# EAGLE design clock (EAGLE 9.6.2)
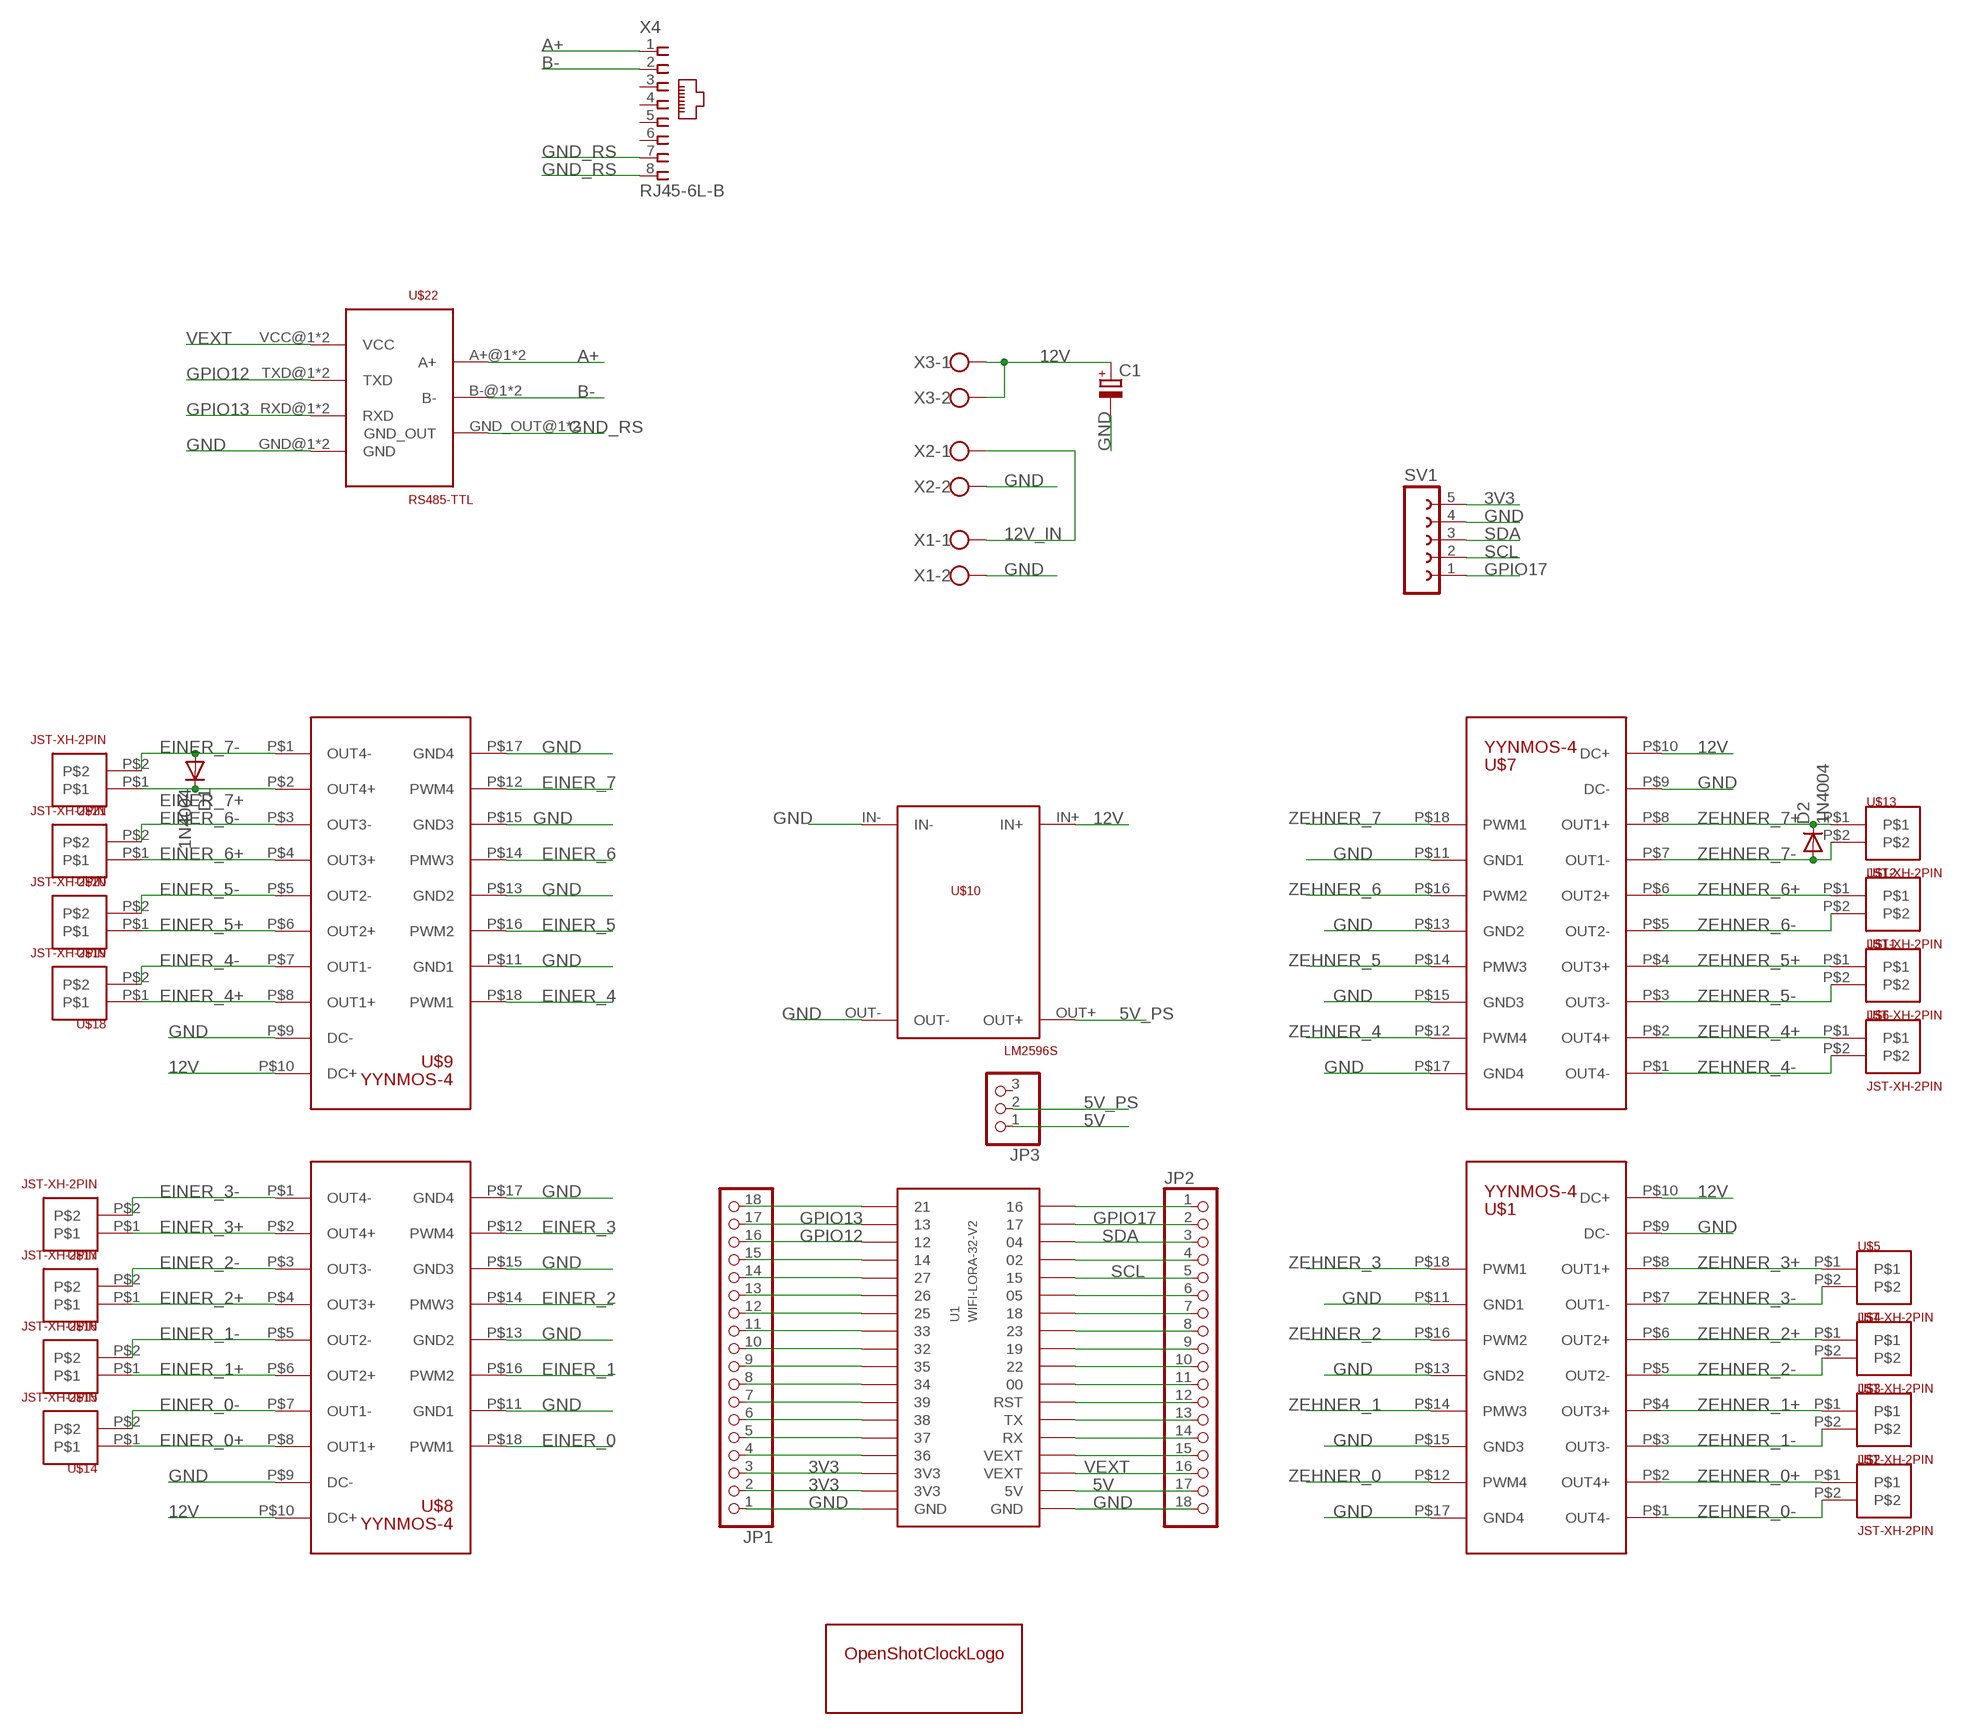
[diagram p0: schematic, sheet 1, part 1 of 2]
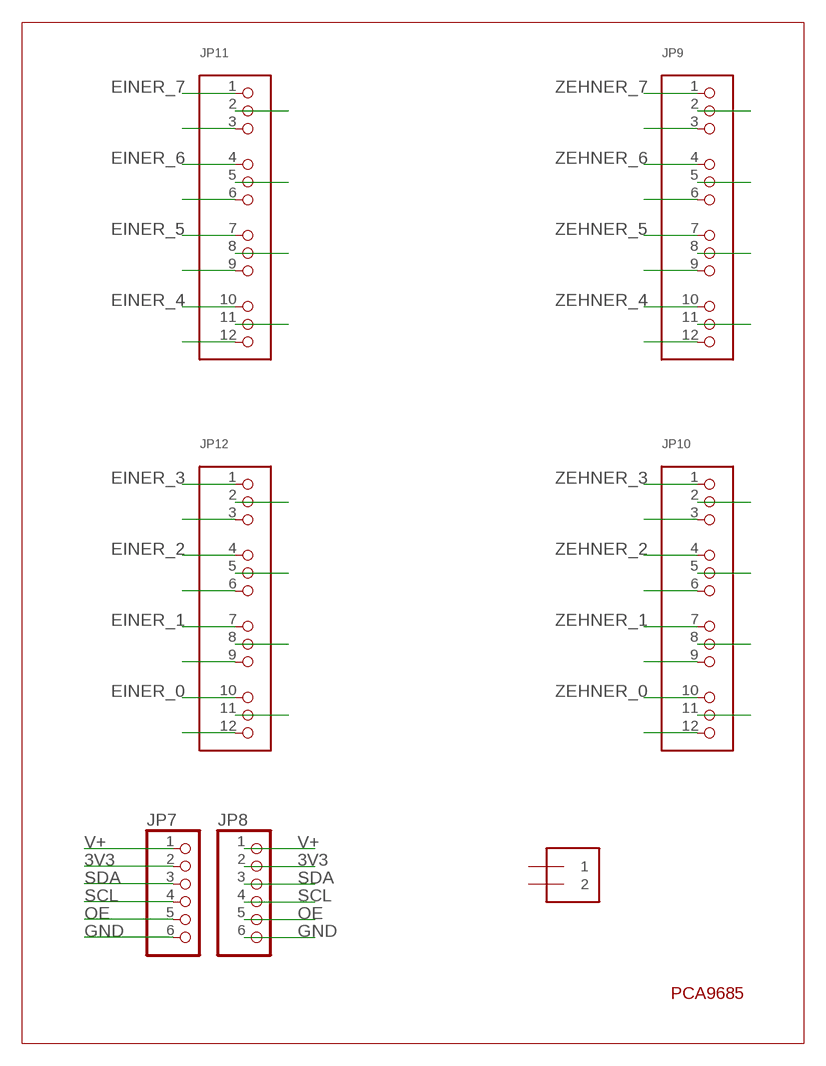
[diagram p1: schematic, sheet 1, part 2 of 2]

## Parts
C1  CPOL-EUE2.5-6  [E2,5-6]
D1  1N4004  [DO41-10]
D2  1N4004  [DO41-10]
J2  TERMBLOCK_1X2-3.5MM  [1X2-3.5MM]
JP1  PINHD-1X18  [1X18]
JP2  PINHD-1X18  [1X18]
JP3  PINHD-1X3  [1X03]
JP7  PINHD-1X6CB  [1X06-CLEANBIG]
JP8  PINHD-1X6CB  [1X06-CLEANBIG]
JP9  HEADER-3X04  [3X04]
JP10  HEADER-3X04  [3X04]
JP11  HEADER-3X04  [3X04]
JP12  HEADER-3X04  [3X04]
SV1  FE05-1  [FE05-1]
U1  WIFI-LORA-32-V2  [2.54MM_2X18]
U$1  YYNMOS-4  [YYNMOS-4]
U$2  JST-XH-2PIN  [JST-XH-2PIN]
U$3  JST-XH-2PIN  [JST-XH-2PIN]
U$4  JST-XH-2PIN  [JST-XH-2PIN]
U$5  JST-XH-2PIN  [JST-XH-2PIN]
U$6  JST-XH-2PIN  [JST-XH-2PIN]
U$7  YYNMOS-4  [YYNMOS-4]
U$8  YYNMOS-4  [YYNMOS-4]
U$9  YYNMOS-4  [YYNMOS-4]
U$10  LM2596S  [LM2596S]
U$11  JST-XH-2PIN  [JST-XH-2PIN]
U$12  JST-XH-2PIN  [JST-XH-2PIN]
U$13  JST-XH-2PIN  [JST-XH-2PIN]
U$14  JST-XH-2PIN  [JST-XH-2PIN]
U$15  JST-XH-2PIN  [JST-XH-2PIN]
U$16  JST-XH-2PIN  [JST-XH-2PIN]
U$17  JST-XH-2PIN  [JST-XH-2PIN]
U$18  JST-XH-2PIN  [JST-XH-2PIN]
U$19  JST-XH-2PIN  [JST-XH-2PIN]
U$20  JST-XH-2PIN  [JST-XH-2PIN]
U$21  JST-XH-2PIN  [JST-XH-2PIN]
U$22  RS485-TTL  [RS485-TTL]
U$23  OPEN-SHOT-CLOCK-LOGO  [OPEN-SHOT-CLOCK-LOGO]
X1  W237-102  [W237-102]
X2  W237-102  [W237-102]
X3  W237-102  [W237-102]
X4  RJ45-6L-B  [RJ45-NO-SHIELD]

## Nets
3V3: JP1.2 JP1.3 JP7.2 JP8.2 SV1.5 U1.P$34(3V3) U1.P$35(3V3)
5V: JP2.17 JP3.1 U1.P$2(5V)
5V_PS: JP3.2 U$10.OUT+
12V: C1.+ U$1.P$10(DC+) U$7.P$10(DC+) U$8.P$10(DC+) U$9.P$10(DC+) U$10.IN+ X3.1 X3.2
12V_IN: X1.1 X2.1
A+: U$22.A+@1(A+) U$22.A+@2(A+) X4.1
B-: U$22.B-@1(B-) U$22.B-@2(B-) X4.2
EINER_0: JP12.10 U$8.P$18(PWM1)
EINER_0+: U$8.P$8(OUT1+) U$14.P$1
EINER_0-: U$8.P$7(OUT1-) U$14.P$2
EINER_1: JP12.7 U$8.P$16(PWM2)
EINER_1+: U$8.P$6(OUT2+) U$15.P$1
EINER_1-: U$8.P$5(OUT2-) U$15.P$2
EINER_2: JP12.4 U$8.P$14(PMW3)
EINER_2+: U$8.P$4(OUT3+) U$16.P$1
EINER_2-: U$8.P$3(OUT3-) U$16.P$2
EINER_3: JP12.1 U$8.P$12(PWM4)
EINER_3+: U$8.P$2(OUT4+) U$17.P$1
EINER_3-: U$8.P$1(OUT4-) U$17.P$2
EINER_4: JP11.10 U$9.P$18(PWM1)
EINER_4+: U$9.P$8(OUT1+) U$18.P$1
EINER_4-: U$9.P$7(OUT1-) U$18.P$2
EINER_5: JP11.7 U$9.P$16(PWM2)
EINER_5+: U$9.P$6(OUT2+) U$19.P$1
EINER_5-: U$9.P$5(OUT2-) U$19.P$2
EINER_6: JP11.4 U$9.P$14(PMW3)
EINER_6+: U$9.P$4(OUT3+) U$20.P$1
EINER_6-: U$9.P$3(OUT3-) U$20.P$2
EINER_7: JP11.1 U$9.P$12(PWM4)
EINER_7+: D1.C U$9.P$2(OUT4+) U$21.P$1
EINER_7-: D1.A U$9.P$1(OUT4-) U$21.P$2
GND: C1.- JP1.1 JP2.18 JP7.6 JP8.6 SV1.4 U1.P$1(GND) U1.P$36(GND) U$1.P$9(DC-) U$1.P$11(GND1) U$1.P$13(GND2) U$1.P$15(GND3) U$1.P$17(GND4) U$7.P$9(DC-) U$7.P$11(GND1) U$7.P$13(GND2) U$7.P$15(GND3) U$7.P$17(GND4) U$8.P$9(DC-) U$8.P$11(GND1) U$8.P$13(GND2) U$8.P$15(GND3) U$8.P$17(GND4) U$9.P$9(DC-) U$9.P$11(GND1) U$9.P$13(GND2) U$9.P$15(GND3) U$9.P$17(GND4) U$10.IN- U$10.OUT- U$22.GND@1(GND) U$22.GND@2(GND) X1.2 X2.2
GND_RS: U$22.GND_OUT@1(GND_OUT) U$22.GND_OUT@2(GND_OUT) X4.7 X4.8
GPIO12: JP1.16 U1.P$21 U$22.TXD@1(TXD) U$22.TXD@2(TXD)
GPIO13: JP1.17 U1.P$20 U$22.RXD@1(RXD) U$22.RXD@2(RXD)
GPIO17: JP2.2 SV1.1 U1.P$17
N$1: JP1.18 U1.P$19
N$4: JP1.15 U1.P$22
N$5: JP1.14 U1.P$23
N$6: JP1.13 U1.P$24
N$7: JP1.12 U1.P$25
N$8: JP1.11 U1.P$26
N$9: JP1.10 U1.P$27
N$10: JP1.9 U1.P$28
N$11: JP1.8 U1.P$29
N$12: JP1.7 U1.P$30
N$13: JP1.6 U1.P$31
N$14: JP1.5 U1.P$32
N$15: JP1.4 U1.P$33
N$16: JP2.1 U1.P$18
N$38: JP2.4 U1.P$15
N$39: JP2.6 U1.P$13
N$40: JP2.7 U1.P$12
N$41: JP2.8 U1.P$11
N$42: JP2.9 U1.P$10
N$43: JP2.10 U1.P$9
N$44: JP2.11 U1.P$8
N$45: JP2.12 U1.P$7(RST)
N$46: JP2.13 U1.P$6(TX)
N$47: JP2.14 U1.P$5(RX)
N$48: JP2.15 U1.P$4(VEXT)
N$71: JP10.3
N$72: JP10.6
N$73: JP10.9
N$74: JP10.12
N$75: JP10.2
N$76: JP10.5
N$77: JP10.8
N$78: JP10.11
N$79: JP12.8
N$80: JP12.5
N$81: JP12.2
N$82: JP12.11
N$83: JP12.12
N$84: JP12.9
N$85: JP12.6
N$86: JP12.3
N$87: JP9.2
N$88: JP9.5
N$89: JP9.8
N$90: JP9.11
N$91: JP9.12
N$92: JP9.9
N$93: JP9.6
N$94: JP9.3
N$95: JP11.3
N$96: JP11.6
N$97: JP11.9
N$98: JP11.12
N$99: JP11.11
N$100: JP11.8
N$101: JP11.5
N$102: JP11.2
OE: JP7.5 JP8.5
SCL: JP2.5 JP7.4 JP8.4 SV1.2 U1.P$14
SDA: JP2.3 JP7.3 JP8.3 SV1.3 U1.P$16
V+: JP7.1 JP8.1
VEXT: JP2.16 U1.P$3(VEXT) U$22.VCC@1(VCC) U$22.VCC@2(VCC)
ZEHNER_0: JP10.10 U$1.P$12(PWM4)
ZEHNER_0+: U$1.P$2(OUT4+) U$2.P$1
ZEHNER_0-: U$1.P$1(OUT4-) U$2.P$2
ZEHNER_1: JP10.7 U$1.P$14(PMW3)
ZEHNER_1+: U$1.P$4(OUT3+) U$3.P$1
ZEHNER_1-: U$1.P$3(OUT3-) U$3.P$2
ZEHNER_2: JP10.4 U$1.P$16(PWM2)
ZEHNER_2+: U$1.P$6(OUT2+) U$4.P$1
ZEHNER_2-: U$1.P$5(OUT2-) U$4.P$2
ZEHNER_3: JP10.1 U$1.P$18(PWM1)
ZEHNER_3+: U$1.P$8(OUT1+) U$5.P$1
ZEHNER_3-: U$1.P$7(OUT1-) U$5.P$2
ZEHNER_4: JP9.10 U$7.P$12(PWM4)
ZEHNER_4+: U$6.P$1 U$7.P$2(OUT4+)
ZEHNER_4-: U$6.P$2 U$7.P$1(OUT4-)
ZEHNER_5: JP9.7 U$7.P$14(PMW3)
ZEHNER_5+: U$7.P$4(OUT3+) U$11.P$1
ZEHNER_5-: U$7.P$3(OUT3-) U$11.P$2
ZEHNER_6: JP9.4 U$7.P$16(PWM2)
ZEHNER_6+: U$7.P$6(OUT2+) U$12.P$1
ZEHNER_6-: U$7.P$5(OUT2-) U$12.P$2
ZEHNER_7: JP9.1 U$7.P$18(PWM1)
ZEHNER_7+: D2.C U$7.P$8(OUT1+) U$13.P$1
ZEHNER_7-: D2.A U$7.P$7(OUT1-) U$13.P$2
Unconnected: J2.1 J2.2 JP3.3 X4.3 X4.4 X4.5 X4.6

## Notes on the sheet
- PCA9685

## Library data of the parts
C1 = rcl:CPOL-EU: POLARIZED CAPACITOR, European symbol; SPICEPREFIX: C
D1 D2 = adafruit:1N4004: DIODE General purpose 1N400x type rectifier (With bigger pads) http://www.ladyada.net/library/pcb/eaglelibrary.html
J2 = microbuilder:TERMBLOCK_1X2: 3.5mm Terminal block http://www.ladyada.net/library/pcb/eaglelibrary.html
JP1 JP2 = adafruit:PINHD-1X18: PIN HEADER
JP3 = adafruit:PINHD-1X3: PIN HEADER
JP7 JP8 = adafruit:PINHD-1X6: PIN HEADER
JP9-JP12 = microbuilder:HEADER-3X04
SV1 = con-lsta:FE05-1: FEMALE HEADER; OC_FARNELL: unknown; OC_NEWARK: unknown
U1 = ESP32_modules:WIFI-LORA-32-V2
U$1 U$7-U$9 = mosfet_module:YYNMOS-4
U$2-U$6 U$11-U$21 = JST-XH:JST-XH-2PIN
U$10 = LM2596S:LM2596S
U$22 = RS485-TTL:RS485-TTL
U$23 = openShotClockLogo:OPEN-SHOT-CLOCK-LOGO
X1-X3 = con-wago-500:W237-102: WAGO SCREW CLAMP; MPN: 237-102; OC_FARNELL: unknown; OC_NEWARK: 70K9898
X4 = RJ45_from_con-tycoel:RJ45: CORCOM Modular RJ Jacks No Shield Source: www.tycoelectronics.com .. ENG_DS_1654001_1099_RJ_L_0507.pdf; MPN: RJ45-6L-B; OC_FARNELL: unknown; OC_NEWARK: 16R6090

## Board
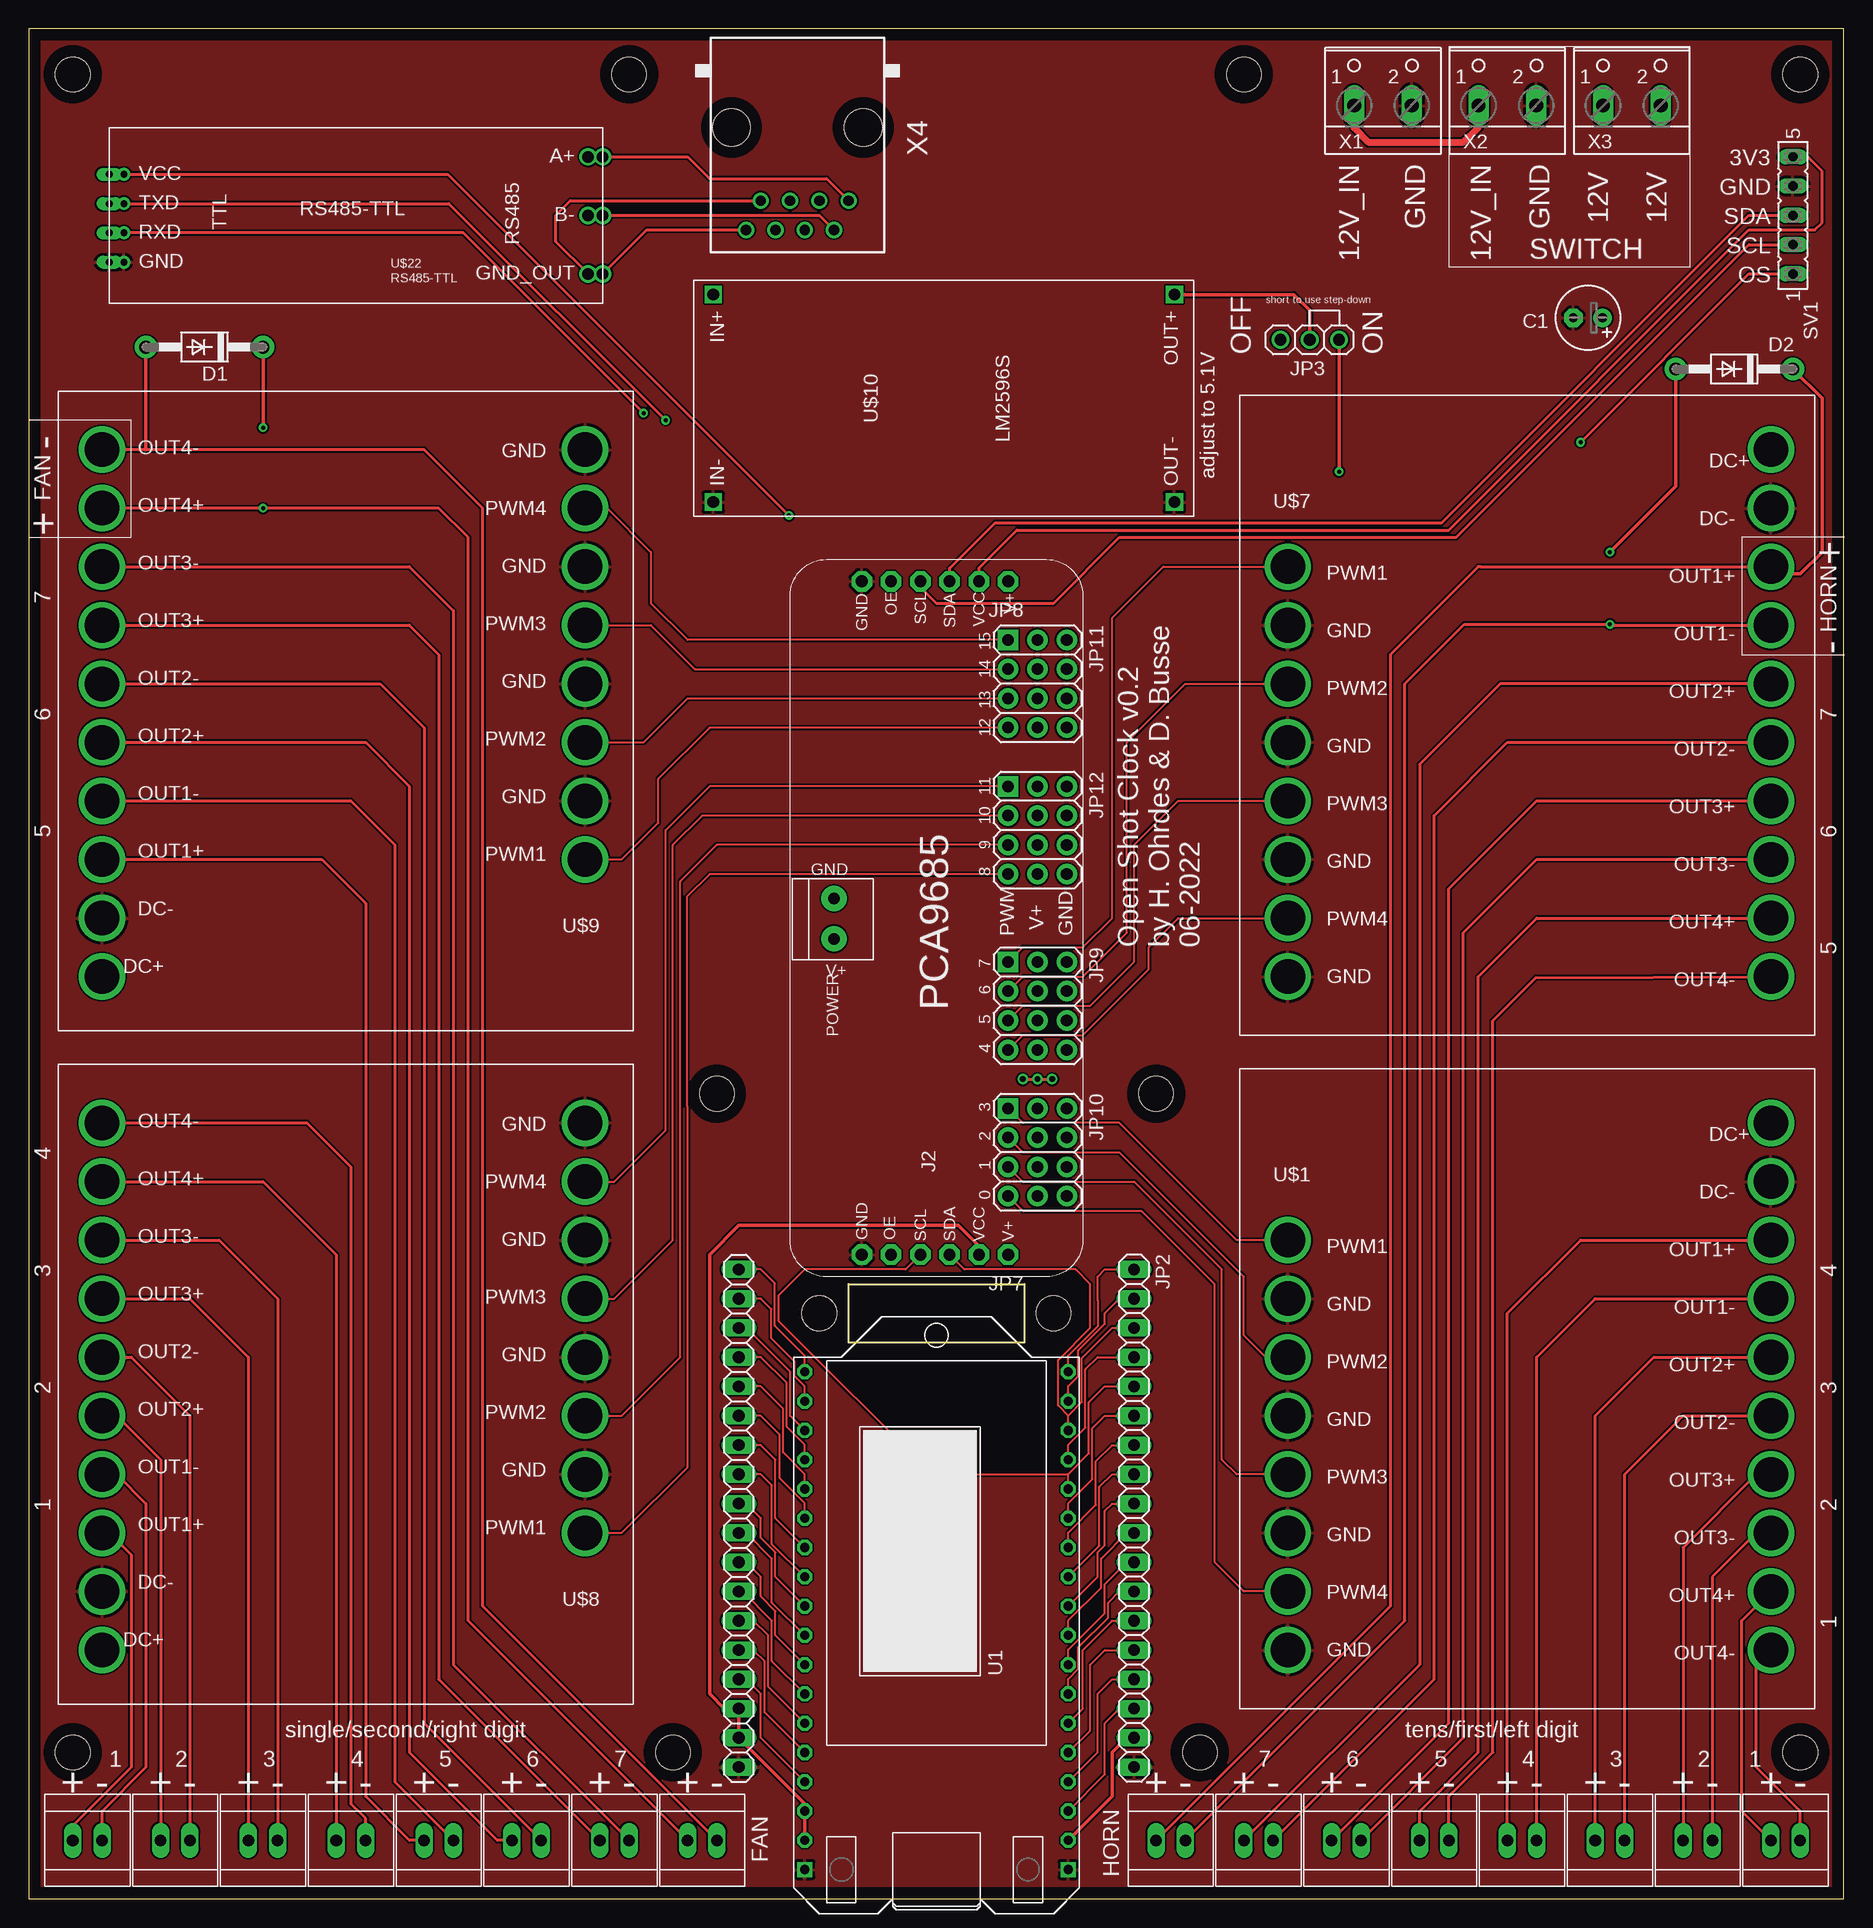
[diagram p2: board, top side]
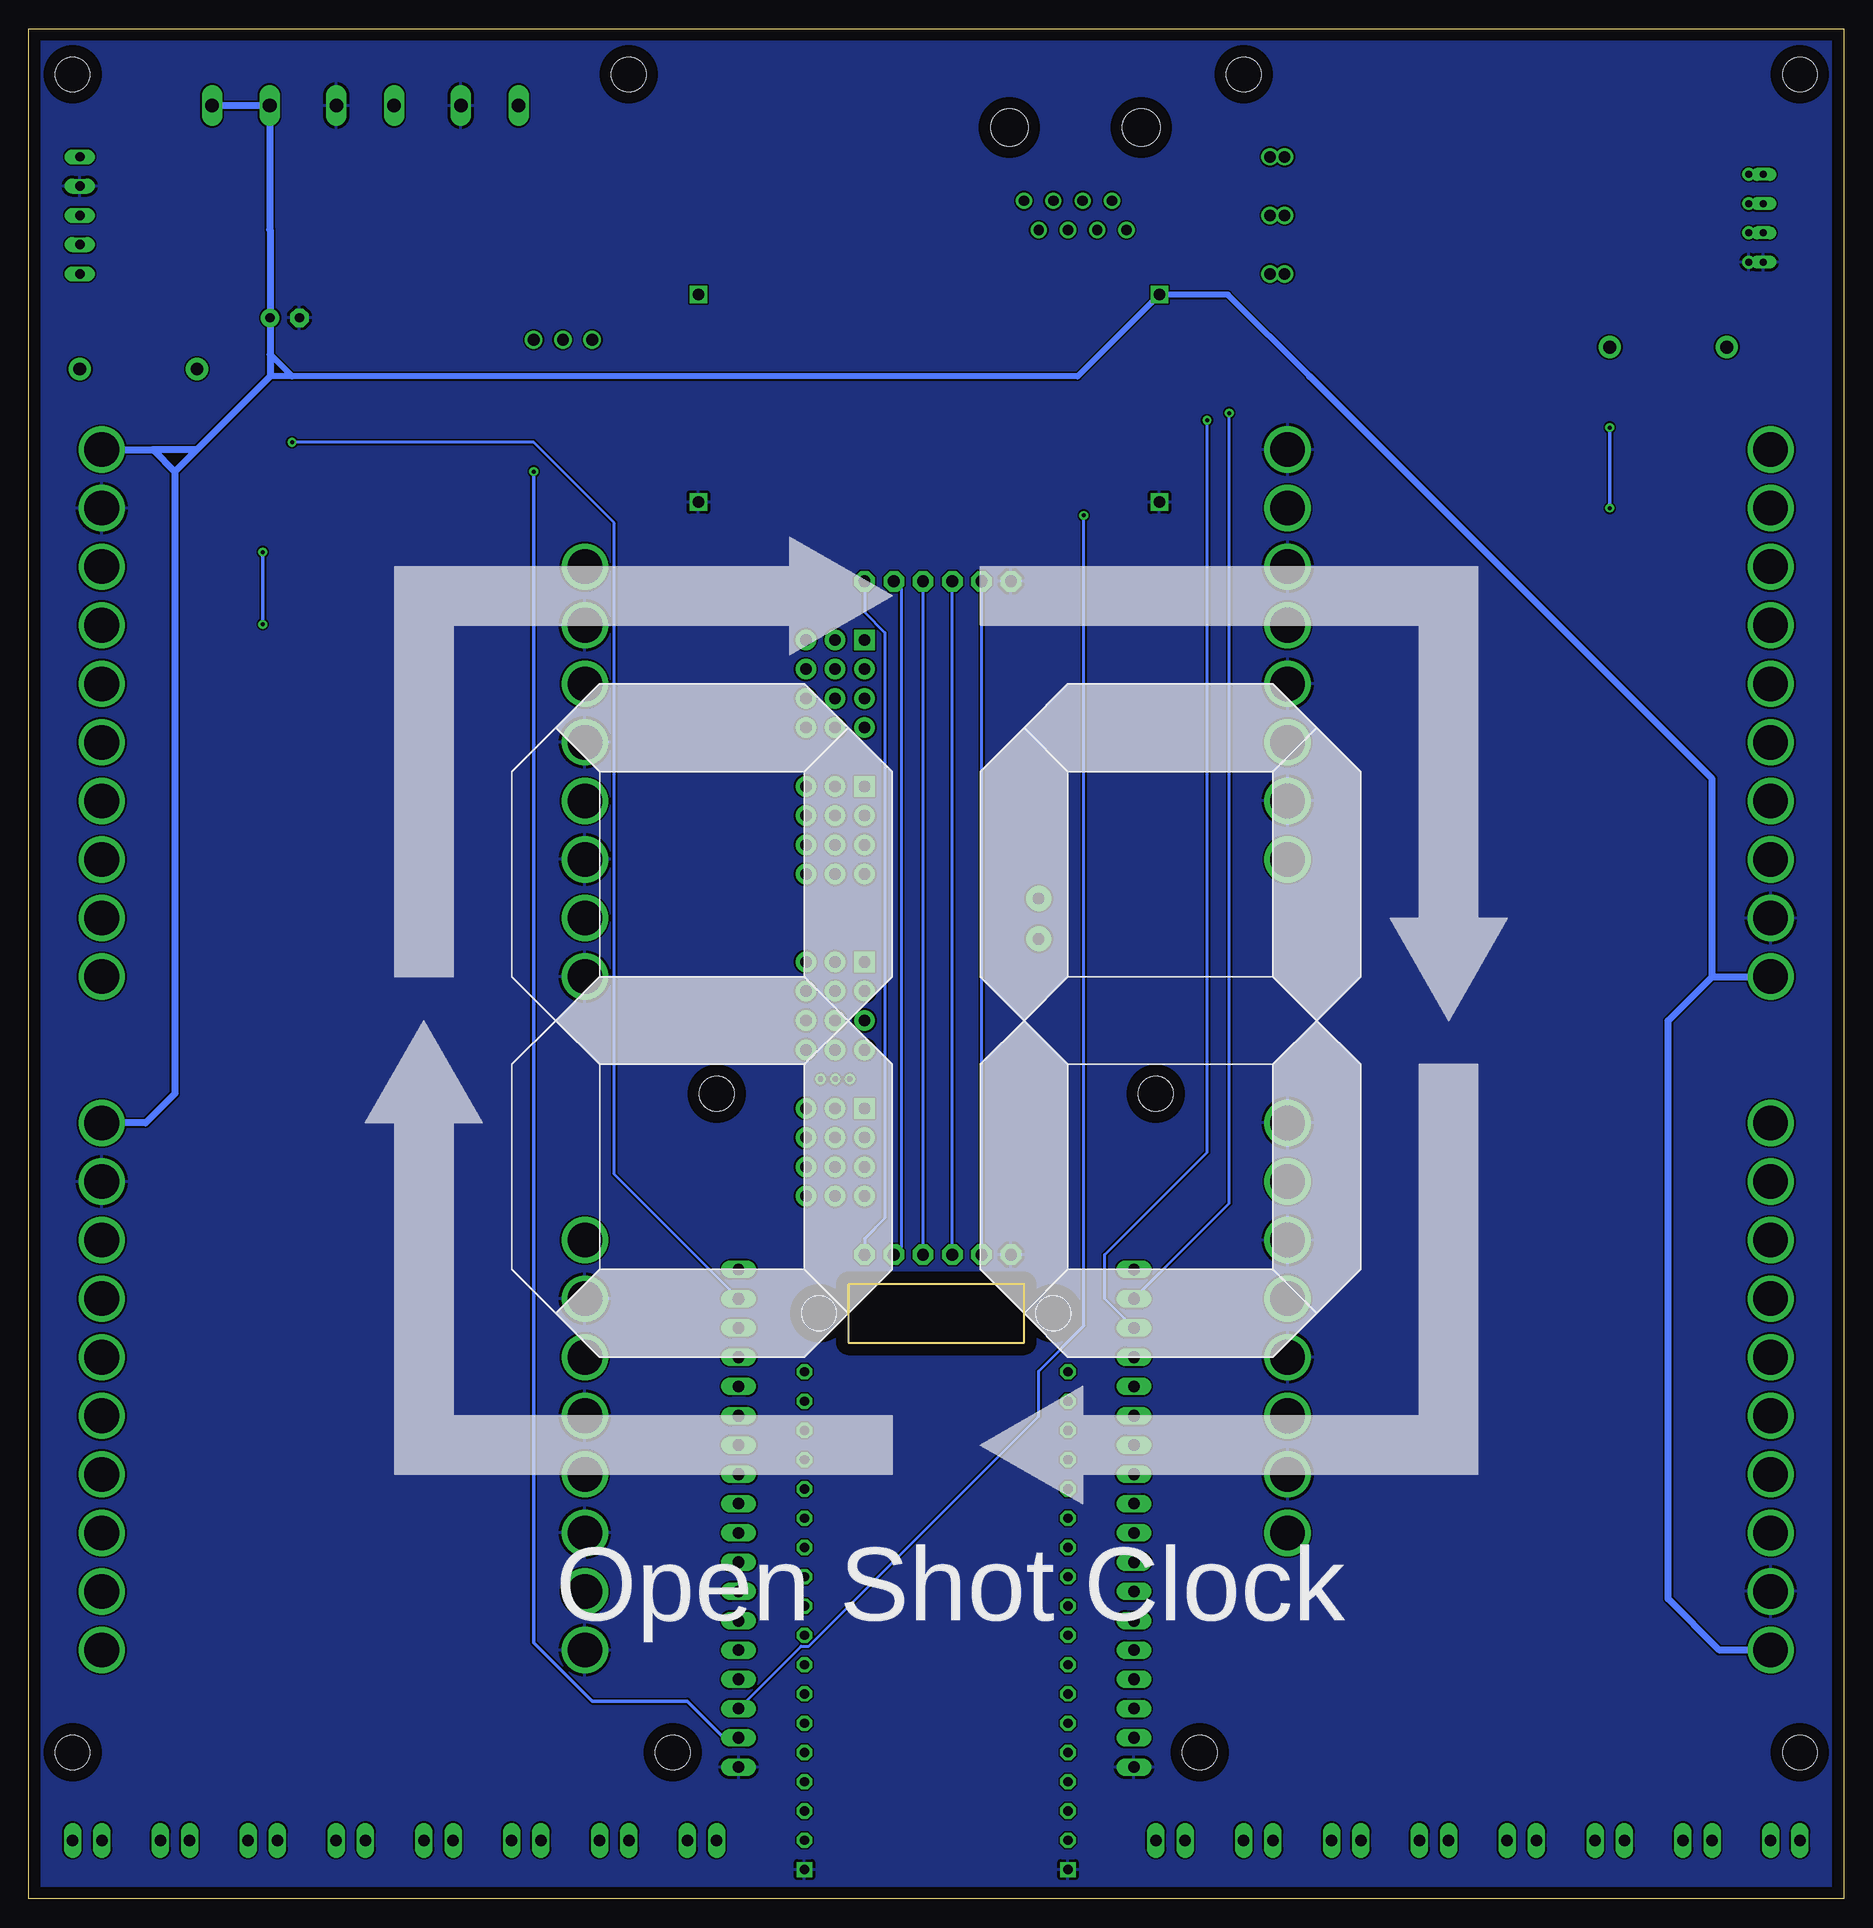
[diagram p3: board, bottom side, seen from below]

Size 157.46 x 162.23 mm. Coordinates in mm from the lower left corner, seen from the top.
Outline: 0,0 157.46,0 157.46,162.23 0,162.23 0,0
Outline: 71.12,48.26 71.12,53.34 86.36,53.34 86.36,48.26 71.12,48.26
Copper layers (1*16): Top 0.035mm / dielectric 1.5mm / Bottom 0.035mm
Design rules "default": minimum track width 6mil, minimum drill 0.35mm, track to track 6mil, track to pad 6mil, pad to pad 6mil, via to via 6mil, smd to smd 6mil, copper to edge 40mil, drill to drill 6mil, minimum pad ring 10mil, minimum via ring 8mil, stop-mask expansion 4mil, vias tented up to drill 0mil, thermal gap 10mil
Holes 3 mm at 59.69,69.85 97.79,69.85 3.81,158.27 153.67,158.27 55.88,12.7 101.6,12.7 153.67,12.7 52.07,158.27 105.41,158.27 3.81,12.7 68.58,50.8 88.9,50.8

### Footprints (pad centres in the part's own frame; a part is rotated, then mirrored left to right if it is on the bottom)
E2,5-6 = drill 0.813 pad 1.6: + -1.27,0 | drill 0.813 pad 1.6 octagon: - 1.27,0
DO41-10 = drill 1.118 pad 1.93: A 5.08,0; C -5.08,0
1X2-3.5MM = drill 1 pad 2.184: 1 1.8,0; 2 -1.7,0
1X18 = drill 1.016 long: 1 -21.59,0; 2 -19.05,0; 3 -16.51,0; 4 -13.97,0; 5 -11.43,0; 6 -8.89,0; 7 -6.35,0; 8 -3.81,0; 9 -1.27,0; 10 1.27,0; 11 3.81,0; 12 6.35,0; 13 8.89,0; 14 11.43,0; 15 13.97,0; 16 16.51,0; 17 19.05,0; 18 21.59,0
1X03 = drill 1.016: 1 -2.54,0; 2 0,0; 3 2.54,0
1X06-CLEANBIG = drill 1.016 pad 1.778 octagon: 1 -6.35,0; 2 -3.81,0; 3 -1.27,0; 4 1.27,0; 5 3.81,0; 6 6.35,0
3X04 = drill 1 pad 1.778 square: 1 -3.81,-2.54 | drill 1 pad 1.778: 2 -3.81,0; 3 -3.81,2.54; 4 -1.27,-2.54; 5 -1.27,0; 6 -1.27,2.54; 7 1.27,-2.54; 8 1.27,0; 9 1.27,2.54; 10 3.81,-2.54; 11 3.81,0; 12 3.81,2.54
FE05-1 = drill 0.813 long: 1 -5.08,0; 2 -2.54,0; 3 0,0; 4 2.54,0; 5 5.08,0
2.54MM_2X18 = drill 0.8 square: P$1 -20.32,-11.43; P$36 -20.32,11.43 | drill 0.8 octagon: P$2 -17.78,-11.43; P$3 -15.24,-11.43; P$4 -12.7,-11.43; P$5 -10.16,-11.43; P$6 -7.62,-11.43; P$7 -5.08,-11.43; P$8 -2.54,-11.43; P$9 0,-11.43; P$10 2.54,-11.43; P$11 5.08,-11.43; P$12 7.62,-11.43; P$13 10.16,-11.43; P$14 12.7,-11.43; P$15 15.24,-11.43; P$16 17.78,-11.43; P$17 20.32,-11.43; P$18 22.86,-11.43; P$19 22.86,11.43; P$20 20.32,11.43; P$21 17.78,11.43; P$22 15.24,11.43; P$23 12.7,11.43; P$24 10.16,11.43; P$25 7.62,11.43; P$26 5.08,11.43; P$27 2.54,11.43; P$28 0,11.43; P$29 -2.54,11.43; P$30 -5.08,11.43; P$31 -7.62,11.43; P$32 -10.16,11.43; P$33 -12.7,11.43; P$34 -15.24,11.43; P$35 -17.78,11.43
YYNMOS-4 = drill 3: P$1 5.08,3.81; P$2 10.16,3.81; P$3 15.24,3.81; P$4 20.32,3.81; P$5 25.4,3.81; P$6 30.48,3.81; P$7 35.56,3.81; P$8 40.64,3.81; P$9 45.72,3.81; P$10 50.8,3.81; P$11 5.08,45.72; P$12 10.16,45.72; P$13 15.24,45.72; P$14 20.32,45.72; P$15 25.4,45.72; P$16 30.48,45.72; P$17 35.56,45.72; P$18 40.64,45.72
JST-XH-2PIN = drill 1 long: P$1 -1.27,0; P$2 1.27,0
LM2596S = drill 1 square: IN+ 9,20; IN- -9,20; OUT+ 9,-20; OUT- -9,-20
RS485-TTL = drill 1: A+@1 42.8,12.7; A+@2 41.53,12.7; B-@1 42.8,7.62; B-@2 41.53,7.62; GND_OUT@1 41.53,2.54; GND_OUT@2 42.8,2.54 | drill 0.6 long: GND@1 0,3.56; RXD@1 0,6.1; TXD@1 0,8.64; VCC@1 0,11.18 | drill 0.6: GND@2 1.27,3.56; RXD@2 1.27,6.1; TXD@2 1.27,8.64; VCC@2 1.27,11.18
W237-102 = drill 1.194 long: 1 -2.5,-1.27; 2 2.5,-1.27
RJ45-NO-SHIELD = drill 0.9 pad 1.4: 1 -4.445,6.35; 2 -3.175,8.89; 3 -1.905,6.35; 4 -0.635,8.89; 5 0.635,6.35; 6 1.905,8.89; 7 3.175,6.35; 8 4.445,8.89 | hole 3.251: -5.715,0; 5.715,0

### Placement (x,y rotation side)
C1  135.25,137.16 180 top
D1  15.24,134.62 180 top
D2  147.96,132.72 180 top
J2  69.85,85.09 270 top
JP1  61.59,33.02 90 top
JP2  95.89,33.02 270 top
JP3  111.12,135.25 180 top
JP7  78.61,55.88 180 top
JP8  78.61,114.3 180 top
JP9  87.5,77.47 270 top
JP10  87.5,64.77 270 top
JP11  87.5,105.41 270 top
JP12  87.5,92.71 270 top
SV1  153.03,146.05 90 top
U1  78.74,22.86 90 top
U$1  154.94,16.51 90 top
U$2  152.4,5.08 0 top
U$3  144.78,5.08 0 top
U$4  137.16,5.08 0 top
U$5  129.54,5.08 0 top
U$6  121.92,5.08 0 top
U$7  154.94,74.93 90 top
U$8  2.54,72.39 270 top
U$9  2.54,130.81 270 top
U$10  79.38,130.18 90 top
U$11  114.3,5.08 0 top
U$12  106.68,5.08 0 top
U$13  99.06,5.08 0 top
U$14  5.08,5.08 0 top
U$15  12.7,5.08 0 top
U$16  20.32,5.08 0 top
U$17  27.94,5.08 0 top
U$18  35.56,5.08 0 top
U$19  43.18,5.08 0 top
U$20  50.8,5.08 0 top
U$21  58.42,5.08 0 top
U$22  6.99,138.43 0 top
U$23  128.27,21.59 0 bottom
X1  117.47,156.84 0 top
X2  128.27,156.84 0 top
X3  139.06,156.84 0 top
X4  66.67,153.67 180 top

### Tracks (layer width: path | path; a pad name or v marks a point on that pad's centre or on a via)
3V3
  Top 0.254: JP8.2 82.42,115.44 85.72,118.75 123.19,118.75 149.22,144.78 154.94,144.78 155.57,145.41 155.57,149.86 154.31,151.13 SV1.5
  Top 0.305: U1.P$35 U1.P$34 67.31,8.26 JP1.2 JP1.3 60.33,16.51 59.05,17.78 59.05,55.88 61.59,58.42 80.64,58.42 82.42,56.64 JP7.2
  Bottom 0.254: JP8.2 81.79,113.67 81.79,56.52 JP7.2
5.0V1  (via drill 0.5)
  Top 0.254: v86.23,71.12 v87.5,71.12 v88.77,71.12
5V  (via drill 0.35)
  Top 0.305: U1.P$2 93.98,8.89 93.98,12.7 95.25,13.97 JP2.17 | v113.67,123.83 JP3.1
  Bottom 0.305: JP2.17 97.16,13.97 100.33,17.14 108.58,17.14 113.67,22.23 v113.67,123.83
5V_PS
  Top 0.305: U$10.OUT+ 109.75,139.18 111.12,137.79 JP3.2
12V
  Bottom 0.508: 134.62,132.08 66.47,132.08 U$10.IN+ 53.45,139.18 46.35,132.08 | 134.62,132.08 136.53,132.08 | 134.62,132.08 136.53,133.99
  Bottom 0.61: U$8.P$10 10.79,21.59 15.24,26.04 15.24,76.2 11.43,80.01 | 11.43,80.01 U$9.P$10 | U$7.P$10 146.69,125.73 | 146.69,125.73 144.78,123.83 | 144.78,123.83 144.78,69.85 147.32,67.31 U$1.P$10 | X3.2 X3.1 136.56,144.82 136.53,144.78 C1.+ 136.53,133.99 136.53,132.08 142.88,125.73 | 142.88,125.73 146.69,125.73 | 142.88,125.73 144.78,123.83 | 11.43,80.01 11.43,97.16 46.35,132.08
12V_IN
  Top 0.61: X1.1 114.97,153.63 116.2,152.4 124.46,152.4 125.77,153.71 X2.1
A+
  Top 0.254: U$22.A+@2 U$22.A+@1 57.15,151.13 59.05,149.22 69.22,149.22 X4.1
B-
  Top 0.254: U$22.B-@2 U$22.B-@1 68.58,146.05 X4.2
EINER_0
  Top 0.152: JP12.10 59.05,88.9 57.1,86.94 57.1,68.78 57.15,68.72 57.15,37.47 51.44,31.75 U$8.P$18
EINER_0+
  Top 0.254: U$14.P$1 3.81,6.35 8.89,11.43 8.89,29.84 6.99,31.75 U$8.P$8
EINER_0-
  Top 0.254: U$14.P$2 6.35,7.62 10.16,11.43 10.16,34.29 7.62,36.83 U$8.P$7
EINER_1
  Top 0.152: JP12.7 59.69,91.44 56.52,88.27 56.52,46.99 51.44,41.91 U$8.P$16
EINER_1+
  Top 0.254: U$15.P$1 11.43,38.1 7.62,41.91 U$8.P$6
EINER_1-
  Top 0.254: U$15.P$2 13.97,41.91 8.89,46.99 U$8.P$5
EINER_2
  Top 0.152: JP12.4 58.42,93.98 55.88,91.44 55.88,57.15 50.8,52.07 U$8.P$14
EINER_2+
  Top 0.254: U$16.P$1 19.05,46.99 13.97,52.07 U$8.P$4
EINER_2-
  Top 0.254: U$16.P$2 21.59,52.07 16.51,57.15 U$8.P$3
EINER_3
  Top 0.152: JP12.1 59.05,96.52 55.24,92.71 55.24,66.67 50.8,62.23 U$8.P$12
EINER_3+
  Top 0.254: U$17.P$1 26.67,55.88 20.32,62.23 U$8.P$2
EINER_3-
  Top 0.254: U$17.P$2 29.21,6.99 27.94,8.26 27.94,63.5 24.13,67.31 U$8.P$1
EINER_4
  Top 0.152: JP11.10 59.05,101.6 54.61,97.16 54.61,93.34 51.44,90.17 U$9.P$18
EINER_4+
  Top 0.254: U$18.P$1 33.02,5.08 29.21,8.89 29.21,86.36 25.4,90.17 U$9.P$8
EINER_4-
  Top 0.254: U$18.P$2 31.75,10.16 31.75,91.44 27.94,95.25 U$9.P$7
EINER_5
  Top 0.152: JP11.7 57.15,104.14 53.34,100.33 U$9.P$16
EINER_5+
  Top 0.254: U$19.P$1 40.64,5.08 33.02,12.7 33.02,96.52 29.21,100.33 U$9.P$6
EINER_5-
  Top 0.254: U$19.P$2 34.29,15.24 34.29,101.6 30.48,105.41 U$9.P$5
EINER_6
  Top 0.152: JP11.4 57.78,106.68 53.98,110.49 U$9.P$14
EINER_6+
  Top 0.254: U$20.P$1 35.56,19.05 35.56,107.95 33.02,110.49 U$9.P$4
EINER_6-
  Top 0.254: U$20.P$2 36.83,20.32 36.83,111.76 33.02,115.57 U$9.P$3
EINER_7
  Top 0.152: JP11.1 57.15,109.22 53.98,112.39 53.98,116.84 50.16,120.65 U$9.P$12
EINER_7+  (via drill 0.35)
  Top 0.254: U$9.P$2 5.24,120.65 v20.32,120.65 35.56,120.65 38.1,118.11 38.1,24.13 U$21.P$1
  Top 0.305: D1.C v20.32,127.64
  Bottom 0.305: v20.32,127.64 v20.32,120.65
EINER_7-
  Top 0.254: U$9.P$1 5.16,125.73 10.16,125.73 34.29,125.73 39.37,120.65 39.37,25.4 U$21.P$2
  Top 0.305: D1.A 10.16,125.73
GND
  pour Top: 0,161.93 0,0 157.48,0 157.48,161.93
  pour Bottom: -1.27,163.19 -1.27,-1.27 158.75,-1.27 158.75,163.19
GND_RS
  Top 0.254: X4.8 53.59,144.78 U$22.GND_OUT@2 U$22.GND_OUT@1 45.72,143.76 45.72,146.05 46.99,147.32 X4.7
GPIO12  (via drill 0.35)
  Top 0.152: U1.P$21 66.04,41.91 66.04,45.72 62.23,49.53 JP1.16
  Top 0.254: U$22.TXD@2 U$22.TXD@1 36.45,147.07 v55.24,128.27
  Bottom 0.254: JP1.16 64.14,52.07 64.14,55.88 55.24,64.77 v55.24,128.27
GPIO13  (via drill 0.35)
  Top 0.152: U1.P$20 67.31,44.47 66.43,45.35 66.43,46.6 64.41,48.62 64.41,51.16 63.5,52.07 JP1.17
  Top 0.254: U$22.RXD@1 U$22.RXD@2 37.69,144.53 v53.33,128.89
  Bottom 0.254: v53.33,128.89 53.33,60.34 JP1.17
GPIO17  (via drill 0.35)
  Top 0.152: U1.P$17 90.17,44.47 91.05,45.35 91.05,47.59 93.34,49.88 93.34,50.8 94.61,52.07 JP2.2
  Top 0.254: v134.62,126.36 149.22,140.97 SV1.1
  Bottom 0.254: JP2.2 106.68,62.87 106.68,119.38 113.67,126.36 v134.62,126.36
N$1
  Top 0.152: U1.P$19 67.31,47.13 64.72,49.73 64.72,53.39 63.5,54.61 JP1.18
N$4
  Top 0.152: U1.P$22 67.31,39.39 65.73,40.97 65.73,44.76 63.5,46.99 JP1.15
N$5
  Top 0.152: U1.P$23 67.31,36.85 65.43,38.73 65.43,42.52 63.5,44.45 JP1.14
N$6
  Top 0.152: U1.P$24 67.31,34.31 65.13,36.5 65.13,40.28 63.5,41.91 JP1.13
N$7
  Top 0.152: U1.P$25 64.77,33.02 64.77,38.1 63.5,39.37 JP1.12
N$8
  Top 0.152: U1.P$26 64.47,30.79 64.47,35.87 63.5,36.83 JP1.11
N$9
  Top 0.152: U1.P$27 64.77,27.94 64.77,30.05 63.5,31.32 63.5,33.02 62.23,34.29 JP1.10
N$10
  Top 0.152: U1.P$28 64.47,25.7 64.47,29.52 62.23,31.75 JP1.9
N$11
  Top 0.152: U1.P$29 64.77,22.86 64.77,24.97 63.5,26.24 63.5,27.94 62.23,29.21 JP1.8
N$12
  Top 0.152: U1.P$30 64.47,20.62 64.47,24.13 61.92,26.67 JP1.7
N$13
  Top 0.152: U1.P$31 64.14,18.41 64.14,22.86 62.87,24.13 JP1.6
N$14
  Top 0.152: U1.P$32 63.83,16.18 63.83,20.62 62.87,21.59 JP1.5
N$15
  Top 0.152: U1.P$33 63.5,13.97 63.5,17.78 62.23,19.05 JP1.4
N$16
  Top 0.152: U1.P$18 90.17,47.13 92.76,49.73 92.76,51.87 92.71,51.93 92.71,53.98 93.34,54.61 JP2.1
N$38
  Top 0.152: U1.P$15 90.17,39.39 91.66,40.88 91.66,45.94 92.71,46.99 JP2.4
N$39
  Top 0.152: U1.P$13 90.17,34.31 92.27,36.41 92.27,40.84 93.34,41.91 JP2.6
N$40
  Top 0.152: U1.P$12 90.17,31.77 92.58,34.18 92.58,37.97 93.98,39.37 JP2.7
N$41
  Top 0.152: U1.P$11 92.88,30.65 92.88,35.73 93.98,36.83 JP2.8
N$42
  Top 0.152: U1.P$10 92.71,27.94 92.71,30.05 93.34,30.68 93.34,33.66 93.98,34.29 JP2.9
N$43
  Top 0.152: U1.P$9 90.17,24.15 93.02,27 93.02,29.52 95.25,31.75 JP2.10
N$44
  Top 0.152: U1.P$8 90.17,21.61 93.32,24.76 93.32,27.28 95.25,29.21 JP2.11
N$45
  Top 0.152: U1.P$7 90.17,19.07 91.05,19.95 91.05,21.84 93.62,24.41 93.62,25.68 94.61,26.67 JP2.12
N$46
  Top 0.152: U1.P$6 91.44,16.51 91.44,21.59 93.98,24.13 JP2.13
N$47
  Top 0.152: U1.P$5 92.08,14.61 92.08,20.32 93.34,21.59 JP2.14
N$48
  Top 0.152: U1.P$4 92.71,12.7 92.71,17.78 93.98,19.05 JP2.15
OE
  Bottom 0.254: JP7.5 JP8.5
SCL
  Top 0.152: U1.P$14 90.17,36.83 | 90.17,36.83 90.17,36.85 91.97,38.65 91.97,43.07 93.34,44.45 JP2.5 | JP7.4 76.07,54.61 67.31,54.61 65.02,52.32 65.02,50.16 78.36,36.83 90.17,36.83
  Top 0.254: JP8.4 77.34,113.79 78.74,112.39 88.9,112.39 94.61,118.11 123.83,118.11 149.22,143.51 SV1.2
  Bottom 0.254: JP7.4 JP8.4
SDA
  Top 0.152: U1.P$16 90.17,41.93 | 90.17,41.93 91.36,43.12 91.36,46.91 93.98,49.53 JP2.3 | 90.17,41.93 89.29,42.81 89.29,46.74 92.08,49.53 92.08,53.34 90.81,54.61 81.15,54.61 JP7.3
  Top 0.254: JP8.3 79.88,115.44 83.82,119.38 122.56,119.38 149.22,146.05 SV1.3
  Bottom 0.254: JP7.3 JP8.3
V+
  Bottom 0.254: JP8.1 84.96,111.63 83.19,109.86 83.19,59.05 84.96,57.28 JP7.1
VEXT  (via drill 0.35)
  Top 0.152: U1.P$3 93.34,10.79 93.34,15.24 94.61,16.51 JP2.16
  Top 0.254: U$22.VCC@1 U$22.VCC@2 36.34,149.61 v65.94,120.02
  Bottom 0.254: JP2.16 90.47,21.93 89.78,21.93 69.85,41.86 69.85,45.79 65.94,49.7 v65.94,120.02
ZEHNER_0
  Top 0.152: JP10.10 86.23,59.69 96.52,59.69 102.87,53.34 102.87,29.21 105.41,26.67 U$1.P$12
ZEHNER_0+
  Top 0.254: U$2.P$1 148.59,7.62 148.59,24.13 150.97,26.51 U$1.P$2
ZEHNER_0-
  Top 0.254: U$2.P$2 153.67,7.62 149.86,11.43 149.86,20.32 151.05,21.51 U$1.P$1
ZEHNER_1
  Top 0.152: JP10.7 86.23,62.23 95.89,62.23 103.5,54.61 103.5,38.1 104.78,36.83 U$1.P$14
ZEHNER_1+
  Top 0.254: U$3.P$1 143.51,30.48 149.86,36.83 U$1.P$4
ZEHNER_1-
  Top 0.254: U$3.P$2 146.05,27.94 149.86,31.75 U$1.P$3
ZEHNER_2
  Top 0.152: JP10.4 86.23,64.77 94.61,64.77 105.41,53.98 105.41,48.9 107.31,46.99 U$1.P$16
ZEHNER_2+
  Top 0.254: U$4.P$1 135.89,41.91 140.97,46.99 U$1.P$6
ZEHNER_2-
  Top 0.254: U$4.P$2 138.43,36.83 142.88,41.27 143.11,41.51 143.51,41.91 U$1.P$5
ZEHNER_3
  Top 0.152: JP10.1 86.23,67.31 94.61,67.31 104.78,57.15 U$1.P$18
ZEHNER_3+
  Top 0.254: U$5.P$1 128.27,50.8 134.62,57.15 U$1.P$8
ZEHNER_3-
  Top 0.254: U$5.P$2 130.81,46.99 135.89,52.07 U$1.P$7
ZEHNER_4
  Top 0.152: JP9.10 86.23,74.93 91.44,74.93 97.16,80.64 97.16,82.55 99.69,85.09 U$7.P$12
ZEHNER_4+
  Top 0.254: U$6.P$1 120.65,7.62 125.73,12.7 125.73,80.01 130.81,85.09 U$7.P$2
ZEHNER_4-
  Top 0.254: U$7.P$1 130.73,79.93 127,76.2 127,12.7 123.19,8.89 U$6.P$2
ZEHNER_5
  Top 0.152: JP9.7 86.23,77.47 92.08,77.47 95.89,81.28 95.89,91.44 99.69,95.25 U$7.P$14
ZEHNER_5+
  Top 0.254: U$11.P$1 123.19,15.24 123.19,87.63 130.81,95.25 U$7.P$4
ZEHNER_5-
  Top 0.254: U$11.P$2 124.46,13.97 124.46,83.82 130.81,90.17 U$7.P$3
ZEHNER_6
  Top 0.152: JP9.4 86.23,80.01 91.44,80.01 95.25,83.82 95.25,100.33 100.33,105.41 U$7.P$16
ZEHNER_6+
  Top 0.254: U$12.P$1 120.65,20.32 120.65,98.42 127.64,105.41 U$7.P$6
ZEHNER_6-
  Top 0.254: U$12.P$2 121.92,19.05 121.92,93.98 128.27,100.33 U$7.P$5
ZEHNER_7
  Top 0.152: JP9.1 86.23,82.55 91.44,82.55 93.98,85.09 93.98,111.12 98.42,115.57 U$7.P$18
ZEHNER_7+
  Top 0.254: U$7.P$8 125.93,115.57 125.72,115.56 118.11,107.95 118.11,25.4 U$13.P$1
  Top 0.305: D2.C 155.57,130.18 155.57,116.84 153.67,114.94 152.41,114.94 U$7.P$8
ZEHNER_7-  (via drill 0.35)
  Top 0.254: U$7.P$7 137.24,110.49 v137.16,110.56 124.53,110.56 119.38,105.41 119.38,24.13 U$13.P$2
  Top 0.305: D2.A 142.88,122.56 v137.16,116.84
  Bottom 0.305: v137.16,116.84 v137.16,110.56

### Text on the board
tPlace: GND | OE | SCL | SDA | VCC | V+ | 15 | 14 | 13 | 12 | 11 | 10 | 9 | GND | 8 | PWM | V+ | GND | V+ | 7 | 6 | PCA9685 | 5 | POWER | 4 | 3 | 2 | 1 | 0 | GND | OE | SCL | SDA | VCC | V+
tNames: 3V3 | 12V_IN | GND | 12V_IN | GND | 12V | 12V | GND | SDA | SCL | SWITCH | OS | short to use step-down | OFF | ON | - | adjust to 5.1V | FAN | + | + | 7 | HORN | - | 6 | 7 | 5 | 6 | Open Shot Clock v0.2 / by H. Ohrdes & D. Busse / 06-2022 | 5 | 4 | 3 | 4 | 2 | 3 | 1 | 2 | 1 | single/second/right digit | tens/first/left digit | 1 | 2 | 3 | 4 | 5 | 6 | 7 | 7 | 6 | 5 | 4 | 3 | 2 | 1 | + | - | + | - | + | - | + | - | + | - | + | - | + | - | + | - | + | - | + | - | + | - | + | - | + | - | + | - | + | - | + | - | FAN | HORN
tValues: 100µF